# EasyEDA Pro project Schmitt Trigger Circuit.eprj

# Schematic Schematic1
Create Date: 2024-03-29; Page Name: P1; Project Name: Schmitt Trigger Circuit; Schematic Name: Schematic1; Update Date: 2024-03-29; Company: EasyEDA.com; Drawn: EasyEDA; Page Size: A4; Part Number: JLCPCB-002; Reviewed: EasyEDA; Version: V0.1
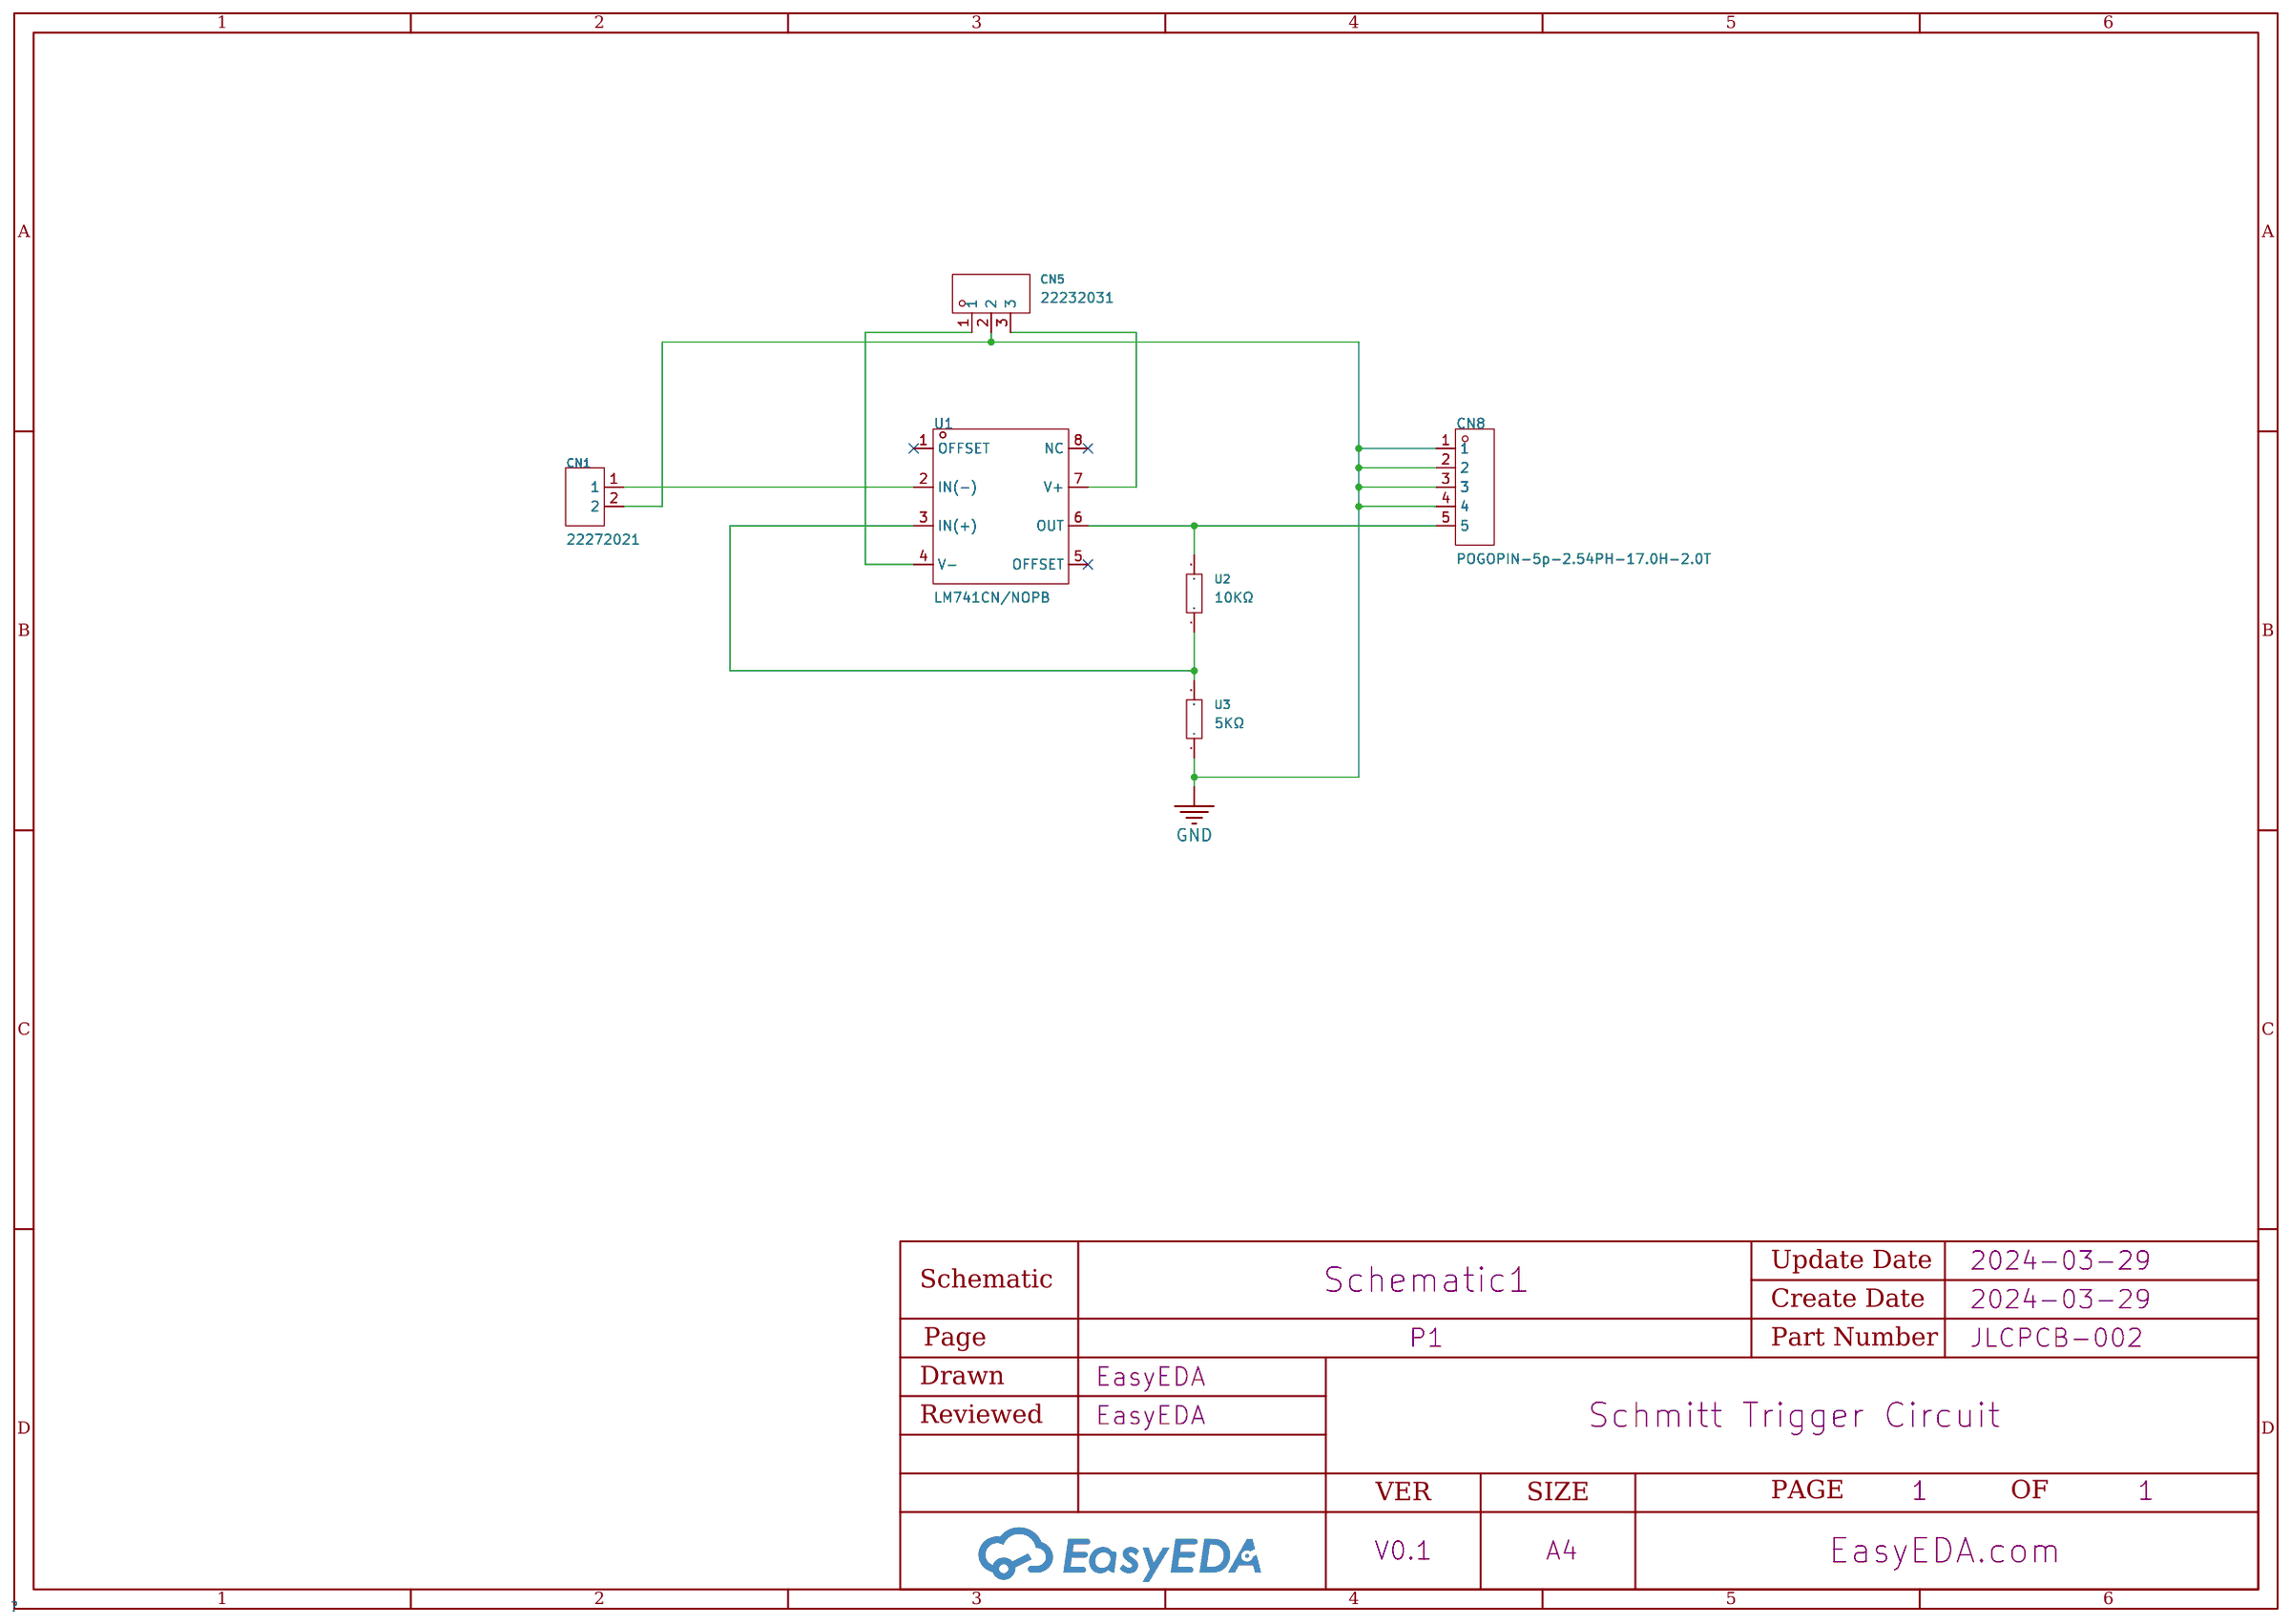
[diagram p0: schematic sheet]

## Parts
CN1  22272021  [CONN-TH_22272021]
CN5  22232031  [CONN-TH_3P-P2.54_22-23-2031]
CN8  POGOPIN-5p-2.54PH-17.0H-2.0T  [CONN-TH_5P-P2.54_POGOPIN-5P-2.54P]
U1  LM741CN/NOPB  [DIP-8_L9.8-W6.6-P2.54-LS7.6-BL]
U2  10KΩ  [RES-TH_BD3.5-L9.0-P13.00-D0.8]
U3  5KΩ  [RES-TH_BD3.5-L9.0-P13.00-D0.8]

## Library data of the parts
CN1 = 22272021: Pins Structure:1x2P Pitch:2.54mm Mounting Style:- Reference Series:- Number of Pins:2P Number of Rows:1 Number of PINs Per Row:2 Row Spacing:- Contact Material:Brass; Supplier Part: C293316; Manufacturer: MOLEX; Supplier Footprint: 插件,P=2.54mm; JLCPCB Part Class: Extended Part; Datasheet: https://atta.szlcsc.com/upload/public/pdf/source/20191223/C471416_BE98D00507934E9FC983B4A2C0217E79.pdf; Supplier: LCSC; Pins Structure: 1x2P; Pitch: 2.54mm; Number of Pins: 2P; Number of Rows: 1; Number of PINs Per Row: 2; Contact Material: Brass
CN5 = 22232031: Pins Structure:1x3P Pitch:2.54mm Mounting Style:- Reference Series:- Number of Pins:3P Number of Rows:1 Number of PINs Per Row:3 Row Spacing:- Contact Material:Brass; LCSC Part Name: 1x3P 间距:2.54mm; Supplier Part: C234181; Manufacturer: MOLEX; Supplier Footprint: 插件,P=2.54mm; JLCPCB Part Class: Extended Part; Datasheet: https://atta.szlcsc.com/upload/public/pdf/source/20200109/C114123_E56320BB7CC6463DA76851D6284C5DE6.pdf; Supplier: LCSC; Pins Structure: 1x3P; Pitch: 2.54mm; Number of Pins: 3P; Number of Rows: 1; Number of PINs Per Row: 3; Contact Material: Brass
CN8 = POGOPIN-5p-2.54PH-17.0H-2.0T: Supplier Part: C9900021779; Supplier Footprint: 5p-2.54PH-17.0H-2.0T; JLCPCB Part Class: Extended Part; Supplier: LCSC
U1 = LM741CN/NOPB: Number of Circuits:单路 Gain Bandwidth Product(GBP):1.5MHz Current - Input Bias(Ib):80nA Slew Rate(SR):0.5V/us Output Current:25mA -3db Bandwidth:- Supply Current:1.5mA Operating Temperature:0℃~+70℃ Operating Temperature:0℃~+70℃; Supplier Part: C13974; Manufacturer: TI(德州仪器); Supplier Footprint: DIP-8; JLCPCB Part Class: Extended Part; Datasheet: https://www.ti.com/cn/lit/gpn/lm741; Supplier: LCSC; Number of Circuits: 单路; Gain Bandwidth Product(GBP): 1.5MHz; Current - Input Bias(Ib): 80nA; Slew Rate(SR): 0.5V/us; Output Current: 25mA; Supply Current: 1.5mA; Operating Temperature: 0℃~+70℃
U2 U3 = FR1WS-5.1Ω±5%: Type:Safety Resistor Resistance: Tolerance:±5% Tolerance:±5% Power(Watts):1W; LCSC Part Name: 5.1Ω ±5% 1W 保险电阻; Supplier Part: C145949; Manufacturer: CCO(千志电子); Supplier Footprint: 插件; JLCPCB Part Class: Extended Part; Datasheet: https://atta.szlcsc.com/upload/public/pdf/source/20171116/C145952_15108222006741123857.pdf; Supplier: LCSC; Type: Safety Resistor; Tolerance: ±5%; Power(Watts): 1W

## Nets
GND: CN1.2 CN5.2 CN8.1 CN8.2 CN8.3 CN8.4 U3.1
$1N682: CN1.1 U1.2(IN(-))
$1N1036: U1.3(IN(+)) U2.1 U3.2
$1N1084: CN5.1 U1.4(V-)
$1N1089: CN5.3 U1.7(V+)
$1N1198: CN8.5 U1.6(OUT) U2.2

Not connected (* = marked no-connect by the designer): U1 1(OFFSET)* 5(OFFSET)* 8(NC)*

# Board PCB1
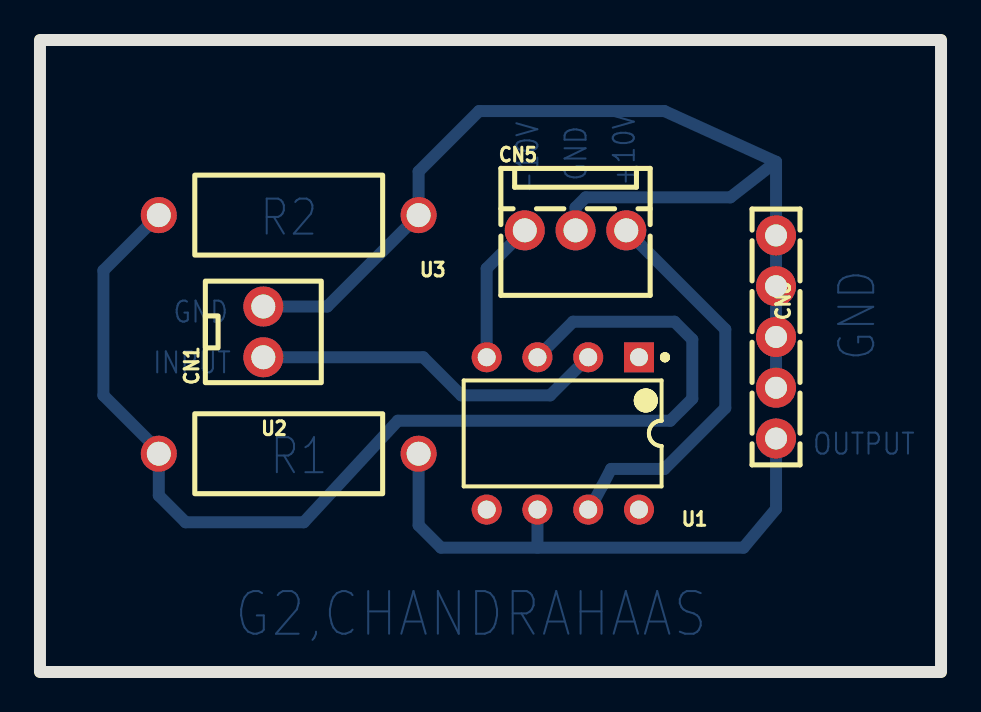
[diagram p1: board, top side]
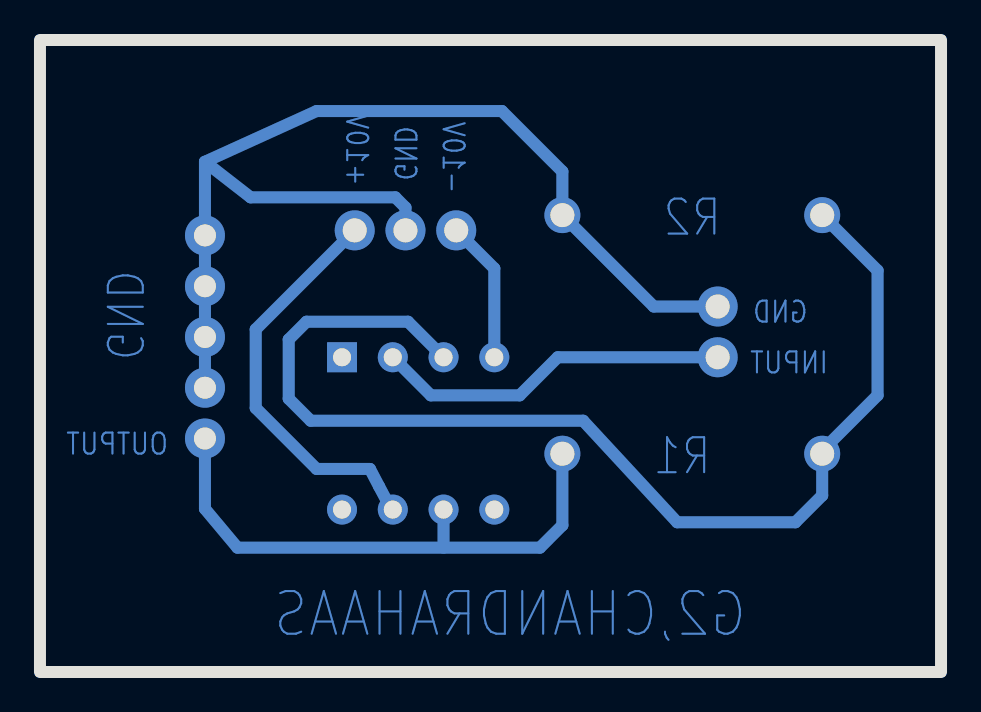
[diagram p2: board, bottom side, seen from below]

Outline 45.08 x 31.62 mm; copper layers: Top Layer, Bottom Layer. Coordinates in mm from the lower left corner of the outline.
Outline path: rectangle 0,31.62 45.08,0
Stack: Top Layer 0.035mm / Dielectric1 1.51mm FR4 er 4.5 / Bottom Layer 0.035mm

## Design rules (mm)
template: Custom Config
spacing copperThickness1oz (default): track to track 0.6, other pairs 0.152 to 0.3
spacing copperThickness2oz: track to track 0.203, other pairs 0.152 to 0.3
track width copperThickness1oz (default): min 0.127, default 0.254, max 2.54
track width copperThickness2oz: min 0.203, default 0.254, max 2.54
differential pair differentialPair (default): width min 0.127, default 0.254, max 2.54; gap min 0.152, default 0.152
via viaSize (default): diameter min 0.5, default 0.61, max 10; hole min 0.3, default 0.305, max 6.3

## Placement (name value [footprint] x y rotation side)
CN1  22272021  [CONN-TH_22272021]  11.18 17.02 90 top
CN5  22232031  [CONN-TH_3P-P2.54_22-23-2031]  26.8 22.1 0 top
CN8  POGOPIN-5p-2.54PH-17.0H-2.0T  [CONN-TH_5P-P2.54_POGOPIN-5P-2.54P]  36.83 16.76 270 top
U1  LM741CN/NOPB  [DIP-8_L9.8-W6.6-P2.54-LS7.6-BL]  26.16 11.94 180 top
U2  10KΩ  [RES-TH_BD3.5-L9.0-P13.00-D0.8]  12.45 10.92 0 top
U3  5KΩ  [RES-TH_BD3.5-L9.0-P13.00-D0.8]  12.45 22.86 180 top

## Footprints (pads in the part's own frame, mm; a bottom-side part is the same pattern mirrored in y, then rotated)
CONN-TH_3P-P2.54_22-23-2031
  round 2 hole 1.2: 1(-2.54,0) 2(0,0) 3(2.54,0)
CONN-TH_5P-P2.54_POGOPIN-5P-2.54P
  round 2 hole 1.1: 1(-5.08,0) 2(-2.54,0) 3(0,0) 4(2.54,0) 5(5.08,0)
CONN-TH_22272021
  round 2 hole 1.2: 1(-1.27,0) 2(1.27,0)
DIP-8_L9.8-W6.6-P2.54-LS7.6-BL
  rect 1.5x1.5 hole 0.9: 1(-3.81,-3.81)
  round 1.5 hole 0.9: 2(-1.27,-3.81) 3(1.27,-3.81) 4(3.81,-3.81) 5(3.81,3.81) 6(1.27,3.81) 7(-1.27,3.81) 8(-3.81,3.81)
RES-TH_BD3.5-L9.0-P13.00-D0.8
  round 1.8 hole 1.2: 1(-6.5,0) 2(6.5,0)

## Nets
As in the schematic.

Pads without a net: U1 1 5 8

## Routing (per net, layer and track width the routed paths; a pad name or vN(x,y) marks a point on that pad's centre or on a via; arc(x,y) is an arc through that point)
GND: length 54.8
  Bottom Layer w0.6: CN1.2 14.37,18.29 U3.1 18.95,25.04 21.97,28.07 31.24,28.07 36.83,25.53 ; CN5.2 26.8,23.24 27.3,23.75 34.54,23.75 36.83,25.53 ; 36.83,25.53 CN8.4
$1N682: length 17.8
  Bottom Layer w0.6: 11.18,15.75 19.18,15.75 21.08,13.84 25.53,13.84 27.43,15.75
$1N1036: length 58.1
  Bottom Layer w0.6: U3.2 3.17,20.09 3.17,13.84 5.95,11.07 U2.1 5.95,8.83 7.29,7.49 13.2,7.49 17.91,12.57 31.54,12.57 32.64,13.67 32.64,16.64 31.75,17.53 26.67,17.53 24.89,15.75
$1N1084: length 7.3
  Bottom Layer w0.6: 22.35,15.62 22.35,20.19 CN5.1
$1N1089: length 20.4
  Bottom Layer w0.6: 27.43,8 28.12,9.29 28.57,10.16 31.24,10.16 34.29,13.21 34.29,17.14 CN5.3
$1N1198: length 28.1
  Bottom Layer w0.6: U2.2 18.95,7.34 20.07,6.22 35.2,6.22 36.83,8.16 CN8.5 ; 24.89,8 24.89,6.22

## Text on the board
Bottom Layer: INPUT | GND | OUTPUT | -10V | +10V | R2 | R1 | G2,CHANDRAHAAS
